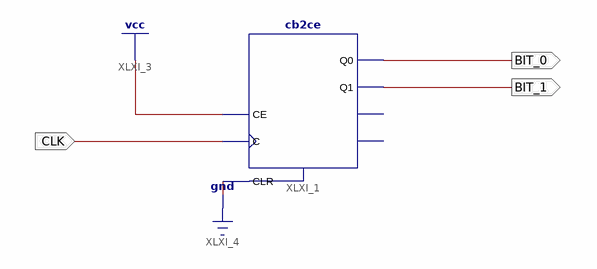
[diagram p0: schematic sheet 1]
// Xilinx ISE schematic COUNTER_4.sch (spartan6) as structural Verilog: 1 symbols, 3 ports
module COUNTER_4 (
  input  CLK,
  output BIT_0,
  output BIT_1
);

  cb2ce XLXI_1 (.C(CLK), .CE(1'b1), .CLR(1'b0), .Q0(BIT_0), .Q1(BIT_1));  // open: CEO, TC
endmodule
